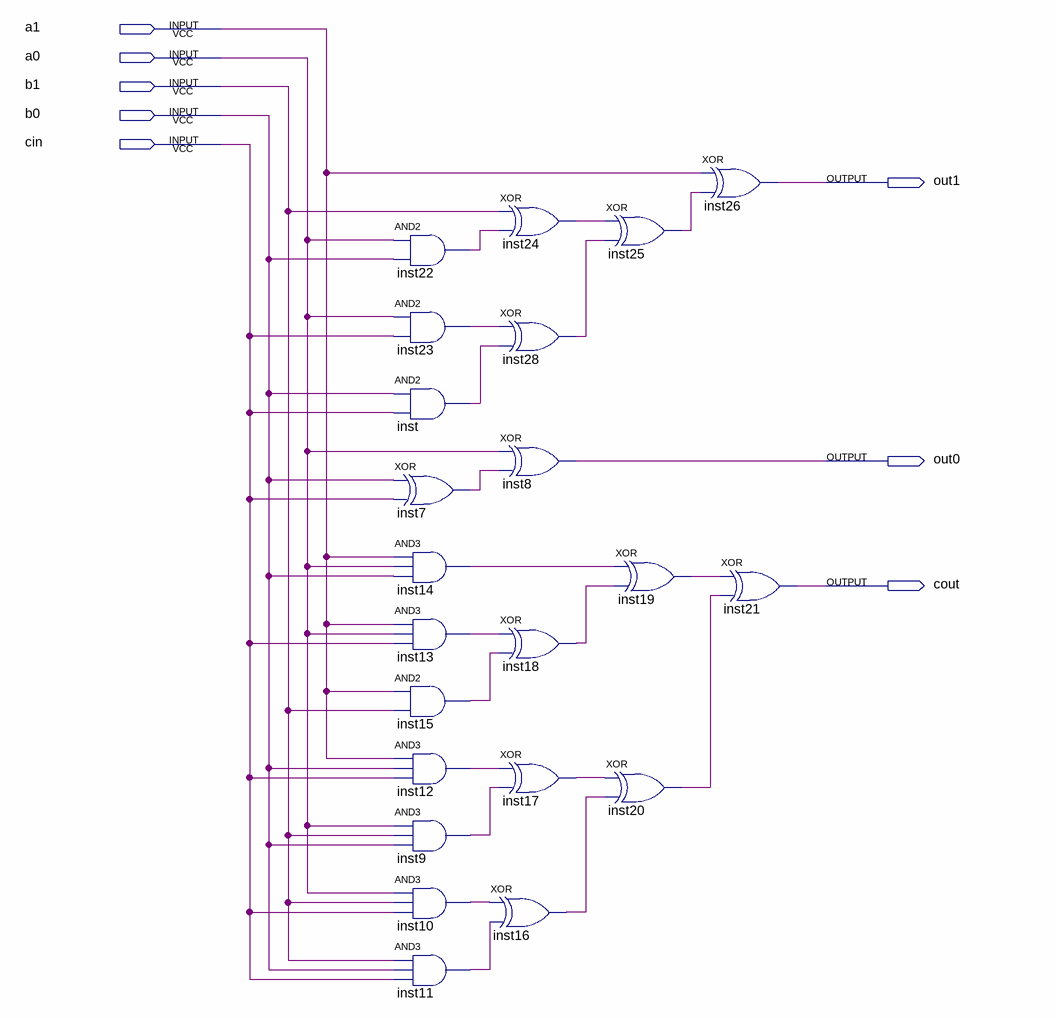
[diagram p0: schematic sheet]
// Quartus schematic lab3.bdf as structural Verilog: 22 symbols, 8 pins
module lab3 (
  input  a1,
  input  a0,
  input  b1,
  input  b0,
  input  cin,
  output out1,
  output out0,
  output cout
);

  wire inst7_out, inst9_out, inst10_out, inst11_out, inst12_out, inst13_out, inst14_out, inst15_out,
       inst16_out, inst17_out, inst18_out, inst19_out, inst20_out, inst22_out, inst23_out, inst24_out,
       inst25_out, inst28_out, inst_out;

  and inst22 (inst22_out, a0, b0);
  and inst23 (inst23_out, a0, cin);
  and inst (inst_out, b0, cin);
  xor inst7 (inst7_out, b0, cin);
  and inst14 (inst14_out, a1, a0, b0);
  and inst13 (inst13_out, a1, a0, cin);
  and inst15 (inst15_out, a1, b1);
  and inst12 (inst12_out, a1, b0, cin);
  and inst9 (inst9_out, a0, b1, b0);
  and inst10 (inst10_out, a0, b1, cin);
  and inst11 (inst11_out, b1, b0, cin);
  xor inst24 (inst24_out, b1, inst22_out);
  xor inst28 (inst28_out, inst23_out, inst_out);
  xor inst8 (out0, a0, inst7_out);
  xor inst18 (inst18_out, inst13_out, inst15_out);
  xor inst17 (inst17_out, inst12_out, inst9_out);
  xor inst16 (inst16_out, inst10_out, inst11_out);
  xor inst25 (inst25_out, inst24_out, inst28_out);
  xor inst19 (inst19_out, inst14_out, inst18_out);
  xor inst20 (inst20_out, inst17_out, inst16_out);
  xor inst26 (out1, a1, inst25_out);
  xor inst21 (cout, inst19_out, inst20_out);
endmodule
